# EAGLE design Lights-ctrl rev01 (EAGLE 9.6.2)
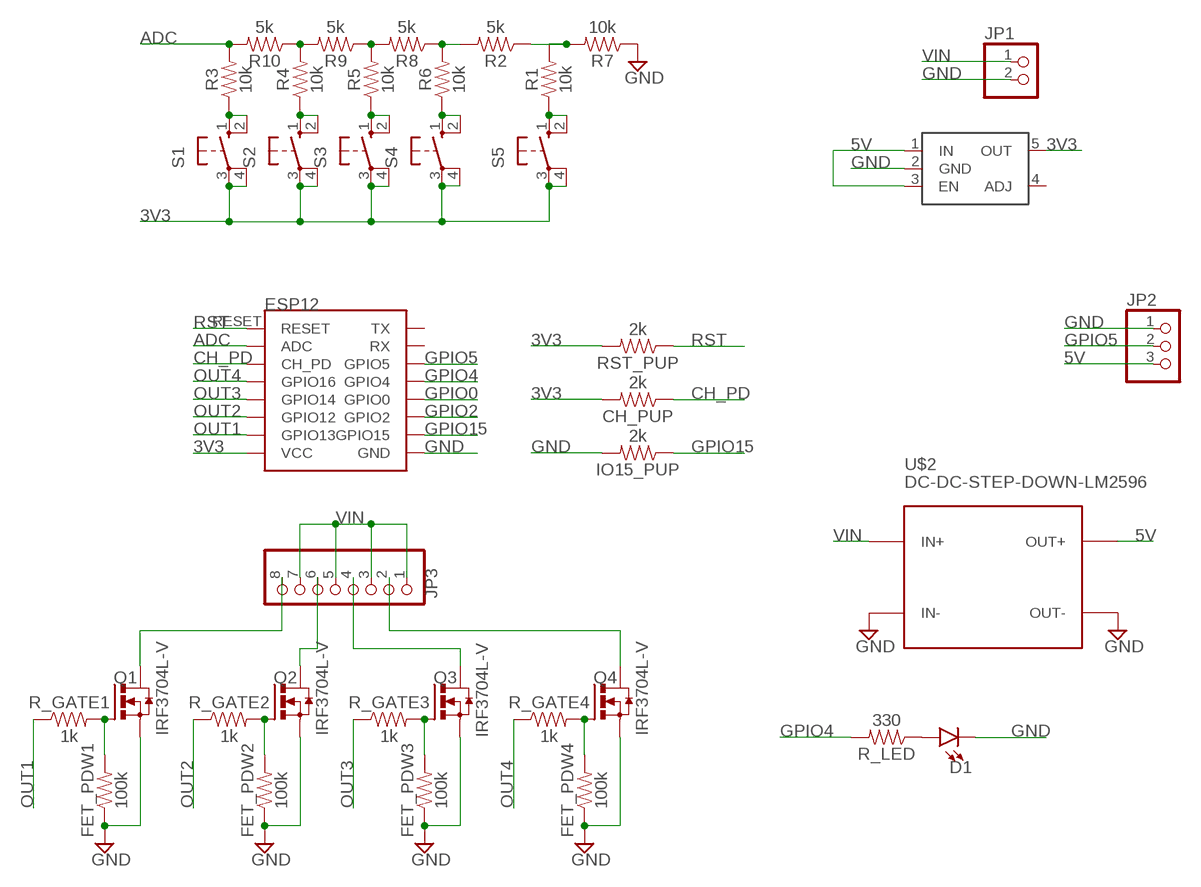
[diagram p0: schematic, sheet 1]

## Parts
CH_PUP  2k  200KOHM-0603-1/10W-1%  [0603]
D1  LED5MM-KIT  [LED_5MM-KIT]
FET_PDW1  100k  200KOHM-0603-1/10W-1%  [0603]
FET_PDW2  100k  200KOHM-0603-1/10W-1%  [0603]
FET_PDW3  100k  200KOHM-0603-1/10W-1%  [0603]
FET_PDW4  100k  200KOHM-0603-1/10W-1%  [0603]
IO15_PUP  2k  200KOHM-0603-1/10W-1%  [0603]
JP1  PINHD-1X2  [1X02]
JP2  PINHD-1X3  [1X03]
JP3  PINHD-1X8/90  [1X08/90]
Q1  IRF3704L-V  [TO262-V]
Q2  IRF3704L-V  [TO262-V]
Q3  IRF3704L-V  [TO262-V]
Q4  IRF3704L-V  [TO262-V]
R1  10k  200KOHM-0603-1/10W-1%  [0603]
R2  5k  200KOHM-0603-1/10W-1%  [0603]
R3  10k  200KOHM-0603-1/10W-1%  [0603]
R4  10k  200KOHM-0603-1/10W-1%  [0603]
R5  10k  200KOHM-0603-1/10W-1%  [0603]
R6  10k  200KOHM-0603-1/10W-1%  [0603]
R7  10k  200KOHM-0603-1/10W-1%  [0603]
R8  5k  200KOHM-0603-1/10W-1%  [0603]
R9  5k  200KOHM-0603-1/10W-1%  [0603]
R10  5k  200KOHM-0603-1/10W-1%  [0603]
R_GATE1  1k  200KOHM-0603-1/10W-1%  [0603]
R_GATE2  1k  200KOHM-0603-1/10W-1%  [0603]
R_GATE3  1k  200KOHM-0603-1/10W-1%  [0603]
R_GATE4  1k  200KOHM-0603-1/10W-1%  [0603]
R_LED  330  200KOHM-0603-1/10W-1%  [0603]
RST_PUP  2k  200KOHM-0603-1/10W-1%  [0603]
S1  10-XX  [B3F-10XX]
S2  10-XX  [B3F-10XX]
S3  10-XX  [B3F-10XX]
S4  10-XX  [B3F-10XX]
S5  10-XX  [B3F-10XX]
U$1  ESP12E-CASTELLATED  [ESP12E-CASTELLATED]
U$2  DC-DC-STEP-DOWN-LM2596  [DC-DC-STEP-DOWN-LM2596]
U$3  MIC5219-BM5  [SOT-23-5]

## Nets
3V3: CH_PUP.2 RST_PUP.2 S1.3(P) S1.4(P1) S2.3(P) S2.4(P1) S3.3(P) S3.4(P1) S4.3(P) S4.4(P1) S5.3(P) S5.4(P1) U$1.VCC U$3.5(OUT)
5V: JP2.3 U$2.OUT+ U$3.1(IN) U$3.3(EN)
ADC: R3.2 R10.2 U$1.ADC
CH_PD: CH_PUP.1 U$1.CH_PD
GND: D1.K(C) FET_PDW1.1 FET_PDW2.1 FET_PDW3.1 FET_PDW4.1 IO15_PUP.2 JP1.2 JP2.1 Q1.3(S) Q2.3(S) Q3.3(S) Q4.3(S) R7.1 U$1.GND U$2.IN- U$2.OUT- U$3.2(GND)
GPIO0: U$1.GPIO0
GPIO2: U$1.GPIO2
GPIO4: R_LED.2 U$1.GPIO4
GPIO5: JP2.2 U$1.GPIO5
GPIO15: IO15_PUP.1 U$1.GPIO15
N$1: FET_PDW4.2 Q4.1(G) R_GATE4.2
N$2: R2.2 R6.2 R8.1
N$3: R5.2 R8.2 R9.1
N$4: R4.2 R9.2 R10.1
N$5: D1.A R_LED.1
N$6: R3.1 S1.1(S) S1.2(S1)
N$7: R4.1 S2.1(S) S2.2(S1)
N$8: R5.1 S3.1(S) S3.2(S1)
N$9: R6.1 S4.1(S) S4.2(S1)
N$10: R1.1 S5.1(S) S5.2(S1)
N$11: JP3.8 Q1.2(D)
N$12: JP3.6 Q2.2(D)
N$13: JP3.4 Q3.2(D)
N$14: JP3.2 Q4.2(D)
N$15: FET_PDW1.2 Q1.1(G) R_GATE1.2
N$16: R1.2 R2.1 R7.2
N$18: FET_PDW2.2 Q2.1(G) R_GATE2.2
N$19: FET_PDW3.2 Q3.1(G) R_GATE3.2
OUT1: R_GATE1.1 U$1.GPIO13
OUT2: R_GATE2.1 U$1.GPIO12
OUT3: R_GATE3.1 U$1.GPIO14
OUT4: R_GATE4.1 U$1.GPIO16
RST: RST_PUP.1 U$1.RESET
VIN: JP1.1 JP3.1 JP3.3 JP3.5 JP3.7 U$2.IN+
Unconnected: U$1.RX U$1.TX U$3.4(ADJ)

## Library data of the parts
CH_PUP FET_PDW1-FET_PDW4 IO15_PUP R1-R10 R_GATE1-R_GATE4 R_LED RST_PUP = SparkFun-Resistors:200KOHM: 200kΩ resistor A resistor is a passive two-terminal electrical component that implements electrical resistance as a circuit element. Resistors act to reduce current flow, and, at the same time, act to lower voltage levels within circuits. - Wikipedia; PROD_ID: RES-09385; VALUE: 200k
D1 = SparkFun-LED:LED: LED (Generic) Standard schematic elements and footprints for 5mm, 3mm, 1206, and 0603 sized LEDs. Generic LEDs with no color specified.
JP1 = pinhead:PINHD-1X2: PIN HEADER
JP2 = pinhead:PINHD-1X3: PIN HEADER
JP3 = pinhead:PINHD-1X8: PIN HEADER
Q1-Q4 = transistor-power:IRF3704: SMPS MOSFET HEXFET® Power MOSFET Source: http://www.irf.com/product-info/datasheets/data/irf3704.pdf
S1-S5 = switch-omron:10-XX: OMRON SWITCH; MPN: B3F-1000; OC_FARNELL: 176432; OC_NEWARK: 36M3542
U$1 = gabriel:ESP12E-CASTELLATED
U$2 = diy modules:DC-DC-STEP-DOWN-LM2596: DC/DC Step-Down Regulator based on LM2596-ADJ chip LM2596 datasheet available here: http://www.ti.com/lit/ds/symlink/lm2596.pdf Click here to find device on ebay.com <http://www.ebay.com/sch/lm2596+power+regulator>
U$3 = gabriel:MIC5219-BM5

## Board
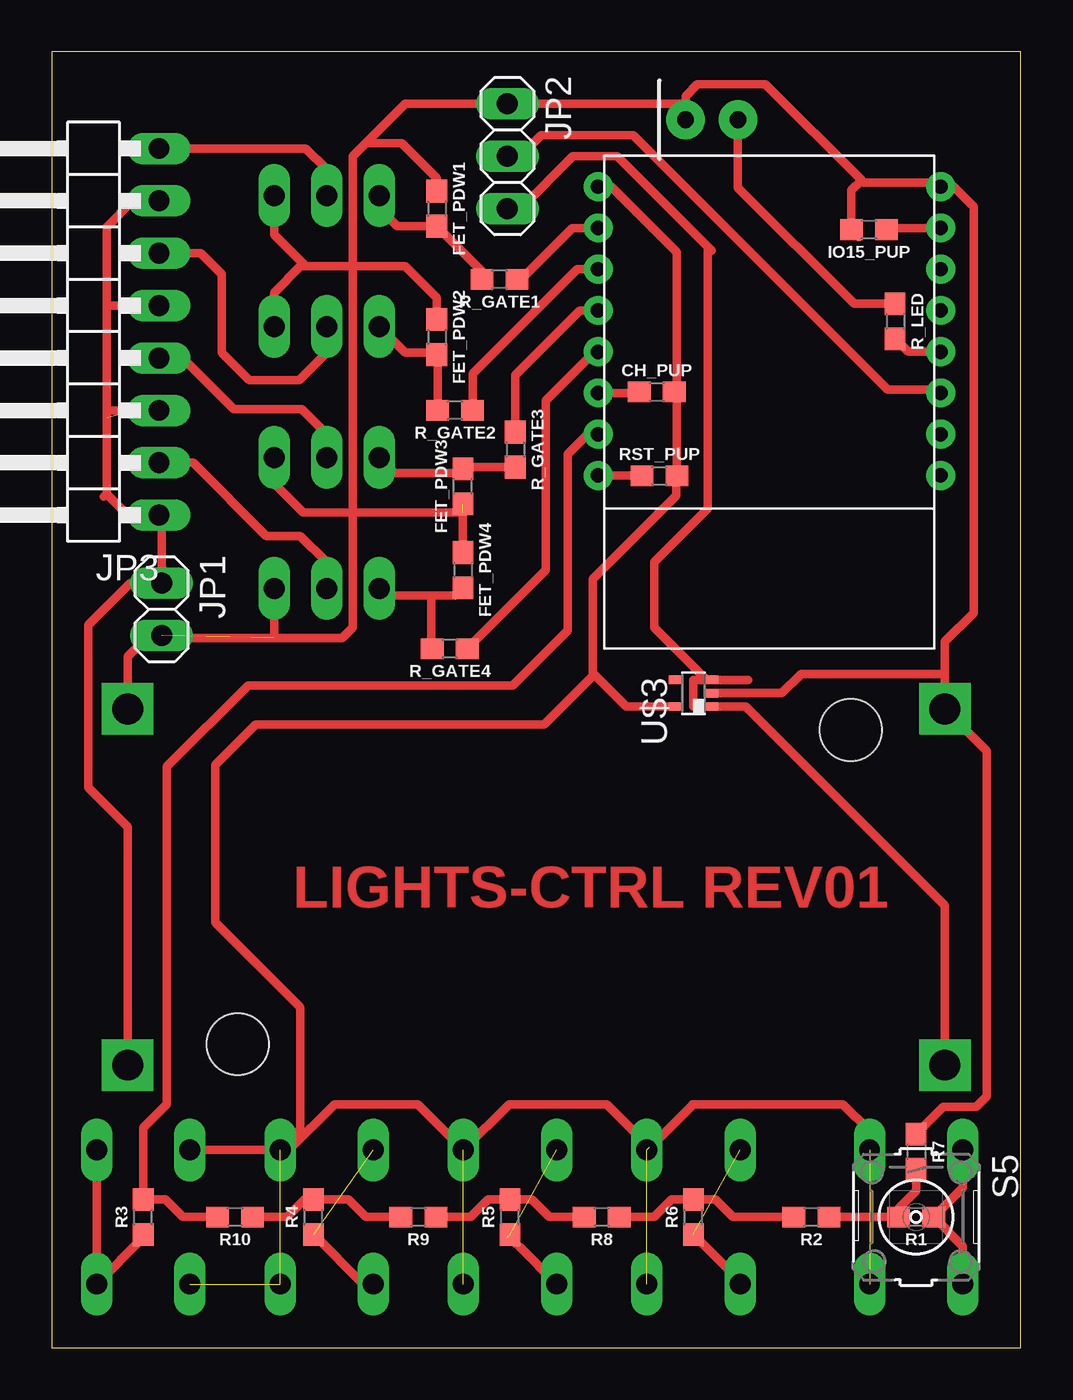
[diagram p1: board, top side]
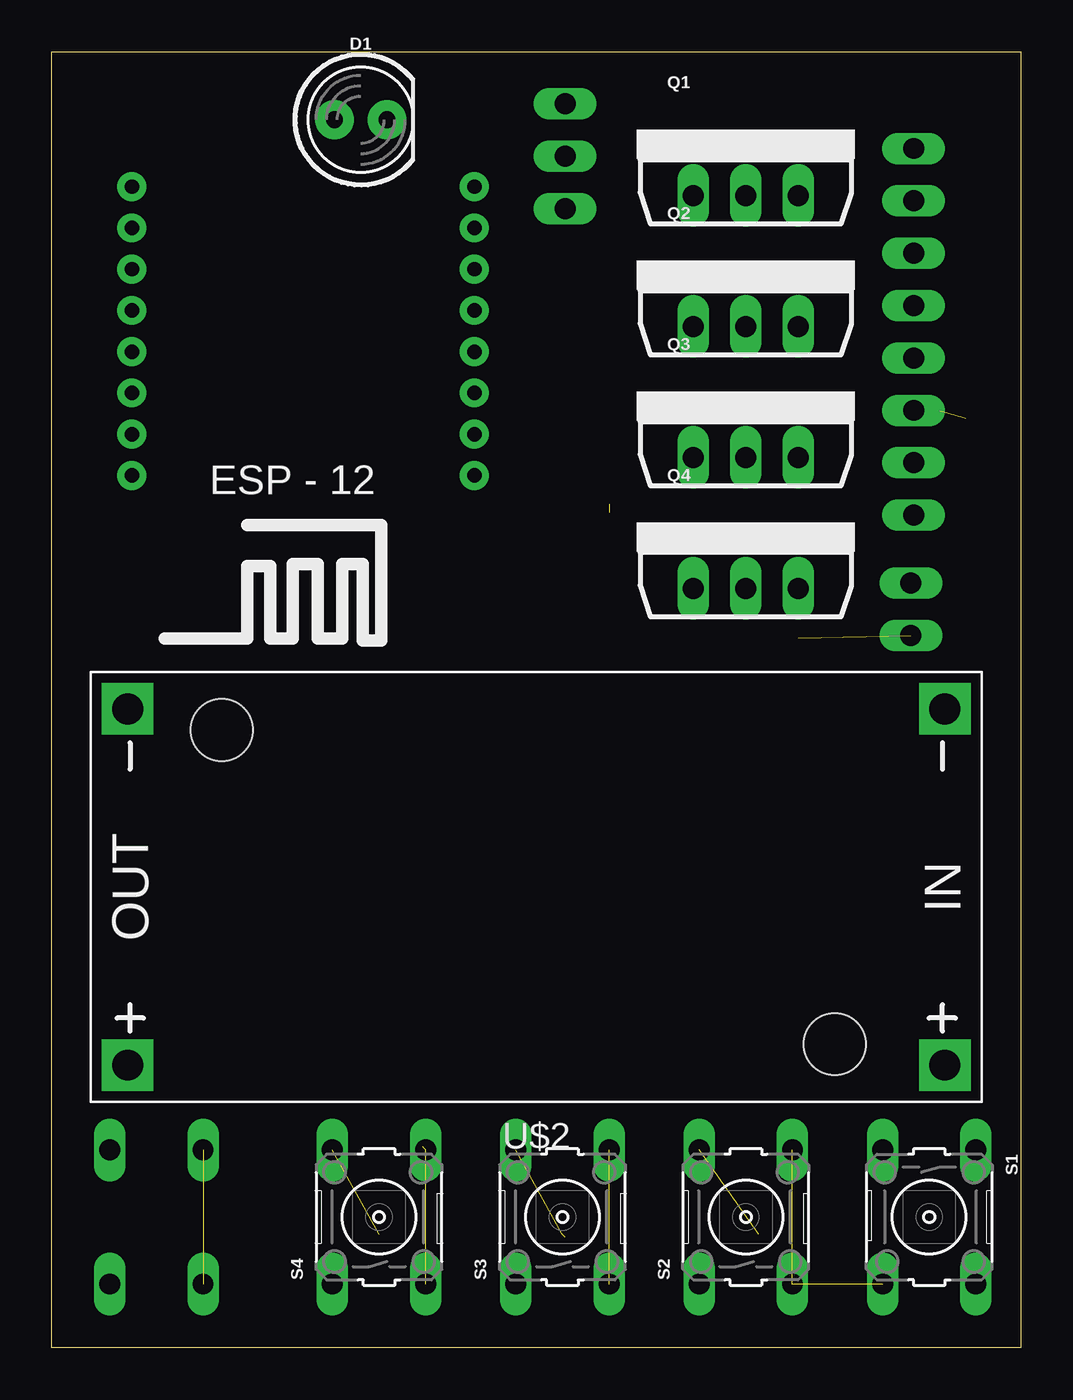
[diagram p2: board, bottom side, seen from below]

Size 46.99 x 62.87 mm. Coordinates in mm from the lower left corner, seen from the top.
Outline: 0,0 46.99,0 46.99,62.87 0,62.87 0,0
Copper layers (1*16): Top 0.035mm / dielectric 1.5mm / Bottom 0.035mm
Design rules "default": minimum track width 6mil, minimum drill 0.35mm, track to track 6mil, track to pad 6mil, pad to pad 6mil, via to via 6mil, smd to smd 6mil, copper to edge 40mil, drill to drill 6mil, minimum pad ring 10mil, minimum via ring 8mil, stop-mask expansion 4mil, vias tented up to drill 0mil, thermal gap 10mil

### Footprints (pad centres in the part's own frame; a part is rotated, then mirrored left to right if it is on the bottom)
0603 = smd 1.1 x 1: 1 -0.85,0; 2 0.85,0
LED_5MM-KIT = drill 0.813 pad 1.88: A -1.27,0; K 1.27,0
1X02 = drill 1.016 long: 1 -1.27,0; 2 1.27,0
1X03 = drill 1.016 long: 1 -2.54,0; 2 0,0; 3 2.54,0
1X08/90 = drill 1.016 long: 1 -8.89,-3.81; 2 -6.35,-3.81; 3 -3.81,-3.81; 4 -1.27,-3.81; 5 1.27,-3.81; 6 3.81,-3.81; 7 6.35,-3.81; 8 8.89,-3.81
TO262-V = drill 1.016 long: 1 -2.54,0; 2 0,0; 3 2.54,0
B3F-10XX = drill 1.016 long: 1 -3.251,2.261; 2 3.251,2.261; 3 -3.251,-2.261; 4 3.251,-2.261
ESP12E-CASTELLATED = drill 0.7 pad 1.4: ADC -8.3,0.9; CH_PD -8.3,-1.1; GND 8.3,-11.1; GPIO0 8.3,-5.1; GPIO2 8.3,-7.1; GPIO4 8.3,-3.1; GPIO5 8.3,-1.1; GPIO12 -8.3,-7.1; GPIO13 -8.3,-9.1; GPIO14 -8.3,-5.1; GPIO15 8.3,-9.1; GPIO16 -8.3,-3.1; RESET -8.3,2.9; RX 8.3,0.9; TX 8.3,2.9; VCC -8.3,-11.1
DC-DC-STEP-DOWN-LM2596 = drill 1.5 pad 2.5 square: IN+ -19.812,8.636; IN- -19.812,-8.636; OUT+ 19.812,8.636; OUT- 19.812,-8.636 | hole 3: -14.478,7.62; 15.24,-7.62
SOT-23-5 = smd 0.4 x 0.7: 1 -0.65,-0.85; 2 0,-0.85; 3 0.65,-0.85; 4 0.65,0.85; 5 -0.65,0.85

### Placement (x,y rotation side)
CH_PUP  29.34,46.35 0 top
D1  32,59.56 0 bottom
FET_PDW1  18.67,55.24 270 top
FET_PDW2  18.67,49.02 270 top
FET_PDW3  19.94,41.78 90 top
FET_PDW4  19.94,37.72 270 top
IO15_PUP  39.62,54.23 180 top
JP1  5.33,35.81 270 top
JP2  22.1,57.78 270 top
JP3  1.4,49.28 90 top
Q1  13.34,55.88 0 bottom
Q2  13.34,49.53 0 bottom
Q3  13.34,43.18 0 bottom
Q4  13.34,36.83 0 bottom
R1  41.91,6.35 180 top
R2  36.83,6.35 180 top
R3  4.45,6.35 90 top
R4  12.7,6.35 90 top
R5  22.23,6.35 90 top
R6  31.11,6.35 90 top
R7  41.91,9.53 270 top
R8  26.67,6.35 180 top
R9  17.78,6.35 180 top
R10  8.89,6.35 180 top
R_GATE1  21.72,51.82 180 top
R_GATE2  19.56,45.47 180 top
R_GATE3  22.48,43.56 270 top
R_GATE4  19.3,33.91 180 top
R_LED  40.89,49.78 270 top
RST_PUP  29.46,42.29 0 top
S1  4.45,6.35 270 bottom
S2  13.34,6.35 90 bottom
S3  22.23,6.35 90 bottom
S4  31.11,6.35 90 bottom
S5  41.91,6.35 270 top
U$1  34.8,45.21 180 bottom
U$2  23.5,22.35 180 bottom
U$3  31.11,31.75 90 top

### Tracks (layer width: path | path; a pad name or v marks a point on that pad's centre or on a via)
3V3  (8 unrouted)
  Top 0.406: U$1.VCC 27.13,56.31 30.31,53.13 30.31,46.48 CH_PUP.2 30.31,46.23 RST_PUP.2 30.28,42.25 30.28,41.33 26.23,37.27 26.23,32.73 26.3,32.65 | S4.4 28.85,9.88 26.92,11.81 22.17,11.81 S3.4 17.75,11.81 13.72,11.81 11.51,9.6 S2.4 | S4.4 29.01,9.75 | 31.06,11.81 31.11,11.81 | 31.11,11.81 38.35,11.81 39.65,10.52 S5.3 | S2.4 S1.3 6.48,9.83 | 31.11,11.81 28.91,9.6 S4.4 | 26.3,32.65 23.88,30.23 9.91,30.23 7.94,28.26 7.94,20.64 12.06,16.51 12.06,10.59 S2.4 | U$3.5 27.85,31.1 26.3,32.65
5V
  Top 0.406: 33.78,32.4 U$3.3 31.75,32.4 | U$3.1 31.98,31.11 33.66,31.11 43.31,21.46 U$2.OUT+ | U$3.1 31.67,31.1 | 31.81,53.4 32,53.21 31.96,53.17 | 31.81,53.4 27.43,57.78 25.27,57.78 22.73,55.24 JP2.3 | U$3.1 31.13,31.1 31.11,31.11 31.11,32.38 31.13,32.4 31.75,32.4 | 31.81,53.4 31.81,40.7 29.21,38.1 29.21,34.94 31.75,32.4
ADC
  Top 0.406: U$1.ADC 25.99,44.31 25.02,43.34 25.02,34.8 22.35,32.13 9.53,32.13 5.59,28.19 5.59,11.81 4.45,10.67 R3.2 5.5,7.2 6.35,6.35 R10.2
CH_PD
  Top 0.406: CH_PUP.1 28.44,46.31 U$1.CH_PD
GND  (2 unrouted)
  Top 0.406: FET_PDW3.1 FET_PDW4.1 | 12.32,52.45 12.06,52.45 10.79,51.18 Q2.3 | 19.94,40.51 14.61,40.51 | 14.61,40.51 14.61,52.45 | Q3.3 10.79,41.91 12.19,40.51 14.61,40.51 | Q1.3 10.79,53.98 12.32,52.45 | 12.32,52.45 14.61,52.45 | Q4.3 10.79,34.42 | IO15_PUP.2 39.13,53.87 | IO15_PUP.2 38.65,54.36 | 14.61,52.45 17.14,52.45 18.67,50.93 FET_PDW2.1 | 14.61,52.45 14.61,57.78 15.24,58.42 | 15.24,58.42 17.14,60.33 JP2.1 30.73,60.33 | IO15_PUP.2 38.77,56.13 39.26,56.62 | 39.26,56.62 39.37,56.52 42.9,56.52 U$1.GND 43.73,56.31 44.7,55.34 44.7,35.65 43.31,34.25 43.31,32.69 | 39.26,56.62 34.61,61.28 31.3,61.28 30.73,60.71 30.73,60.33 | 14.61,40.51 14.61,34.92 14.1,34.42 5.46,34.42 JP1.2 4.7,34.54 3.68,33.53 U$2.IN- | FET_PDW1.1 18.67,56.73 16.98,58.42 15.24,58.42 | 30.73,60.33 D1.K | 43.31,32.69 U$2.OUT- 45.34,28.96 45.34,12.19 44.83,11.68 43.22,11.68 R7.1 | 43.31,32.69 36.34,32.69 35.4,31.75 U$3.2
GPIO4
  Top 0.406: U$1.GPIO4 41.52,48.31 R_LED.2
GPIO5
  Top 0.406: U$1.GPIO5 42.93,46.48 40.52,46.48 28.2,58.8 23.75,58.8 22.73,57.78 JP2.2
GPIO15
  Top 0.406: 40.34,54.19 IO15_PUP.1 40.56,54.31 U$1.GPIO15
N$1
  Top 0.406: 19.91,36.84 FET_PDW4.2 19.56,36.49 18.41,36.49 | 18.41,36.49 15.53,36.49 Q4.1 | R_GATE4.2 18.41,33.95 18.41,36.49
N$2
  Top 0.406: R8.1 29.21,6.35 30.06,7.2 R6.2 32.17,7.2 33.02,6.35 R2.2
N$3
  Top 0.406: R8.2 24.13,6.35 23.28,7.2 R5.2 21.17,7.2 20.32,6.35 R9.1
N$4
  Top 0.406: R9.2 15.24,6.35 14.39,7.2 R4.2 12.28,7.2 11.43,6.35 R10.1
N$5
  Top 0.406: R_LED.1 38.9,50.63 33.27,56.26 D1.A
N$6
  Top 0.406: R3.1 4.45,5.36 S1.2 S1.1
N$7  (1 unrouted)
  Top 0.406: S2.1 15.1,3.1 R4.1
N$8  (2 unrouted)
  Top 0.406: S3.1 22.69,4.9 22.09,5.37
N$9  (1 unrouted)
  Top 0.406: R6.1 33.38,3.24 S4.1
N$10
  Top 0.406: S5.1 44.17,7.76 R1.1 44.17,4.94 S5.2
N$11
  Top 0.406: Q1.2 13.34,57.15 12.32,58.17 JP3.8
N$12
  Top 0.406: Q2.2 13.34,48.26 12,46.93 9.59,46.93 8.26,48.26 8.26,52.07 7.24,53.09 JP3.6
N$13
  Top 0.406: 13.34,44.45 Q3.2 13.34,44.32 12.13,45.53 8.83,45.53 6.35,48.01 JP3.4
N$14
  Top 0.406: 13.34,37.97 Q4.2 13.34,38.1 12.06,39.37 10.41,39.37 6.86,42.93 JP3.2
N$15
  Top 0.406: 16.3,55.46 Q1.1 15.88,55.28 16.76,54.4 FET_PDW1.2 20.87,52.2 R_GATE1.2
N$16
  Top 0.406: R2.1 R1.2 41.06,6.77 41.91,7.62 R7.2
N$18
  Top 0.406: Q2.1 17.14,48.26 18.58,48.26 FET_PDW2.2 18.71,48.13 R_GATE2.2
N$19
  Top 0.406: R_GATE3.2 20.02,42.71 FET_PDW3.2 19.72,42.42 16.64,42.42 Q3.1
OUT1
  Top 0.406: R_GATE1.1 22.73,51.82 25.23,54.31 U$1.GPIO13
OUT2
  Top 0.406: R_GATE2.1 20.41,47.24 25.48,52.31 U$1.GPIO12
OUT3
  Top 0.406: U$1.GPIO14 25.61,50.31 22.48,47.18 R_GATE3.1
OUT4
  Top 0.406: R_GATE4.1 23.96,37.72 23.96,45.94 26.34,48.31 U$1.GPIO16
RST
  Top 0.406: U$1.RESET 26.52,42.29 RST_PUP.1
VIN  (1 unrouted)
  Top 0.406: JP3.5 2.67,50.55 | 2.67,41.4 2.67,45.47 JP3.3 3.94,45.47 | 2.67,50.55 2.67,45.09 | 2.67,41.4 3.68,40.39 5.08,40.39 | JP3.1 5.08,40.39 | JP3.7 3.94,55.63 2.67,54.36 2.67,50.55 | 2.54,41.27 2.67,41.4 | U$2.IN+ 3.68,25.27 1.78,27.18 1.78,35.05 3.81,37.08 JP1.1 5.33,40.13 5.08,40.39

### Text on the board
Top: LIGHTS-CTRL REV01